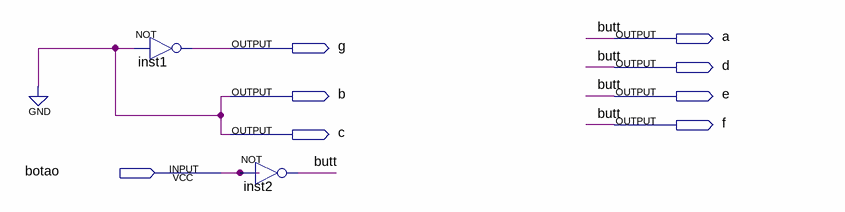
[diagram p0: schematic sheet]
// Quartus schematic estou_apertado.bdf as structural Verilog: 2 symbols, 8 pins
module estou_apertado (
  input  botao,
  output a,
  output g,
  output d,
  output b,
  output e,
  output f,
  output c
);

  not inst1 (g, 1'b0);
  not inst2 (a, botao);

  assign b = 1'b0;
  assign c = 1'b0;
  assign d = a;
  assign e = a;
  assign f = a;

  // Other names for the same wires on the sheet: butt = a
endmodule
